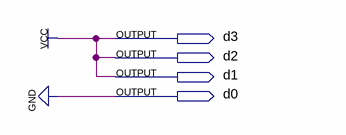
[diagram p0: schematic sheet]
// Quartus schematic d.bdf as structural Verilog: 0 symbols, 4 pins
module d (
  output d3,
  output d2,
  output d1,
  output d0
);


  assign d0 = 1'b0;
  assign d1 = 1'b1;
  assign d2 = 1'b1;
  assign d3 = 1'b1;
endmodule
